# EAGLE design Msp430_doughter (EAGLE 4.16)
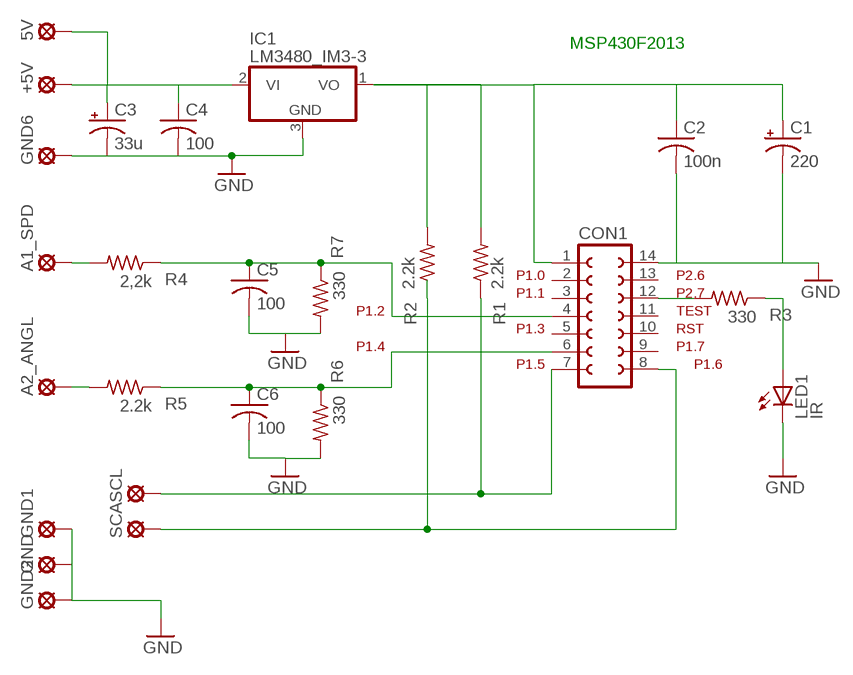
[diagram p0: schematic, sheet 1]

## Parts
5V  LSP10  [LSP10]
+5V  LSP10  [LSP10]
A1_SPD  LSP10  [LSP10]
A2_ANGL  LSP10  [LSP10]
C1  220  CPOL-USD/7343-31W  [D/7343-31W]
C2  100n  C-USC1206  [C1206]
C3  33u  CPOL-USD/7343-31R  [D/7343-31R]
C4  100  C-USC1206  [C1206]
C5  100  C-USC0805  [C0805]
C6  100  C-USC0805  [C0805]
CON1  HEADER_MSP430  [FE07-2]
GND  LSP10  [LSP10]
GND1  LSP10  [LSP10]
GND2  LSP10  [LSP10]
GND6  LSP10  [LSP10]
IC1  LM3480_IM3-3  LM340SOT23-  [SOT23]
LED1  IR  LED3MM  [LED3MM]
R1  2.2k  R-US_0204/7  [0204/7]
R2  2.2k  R-US_0204/7  [0204/7]
R3  330  R-US_R0805  [R0805]
R4  2,2k  R-US_R0805  [R0805]
R5  2.2k  R-US_R0805  [R0805]
R6  330  R-US_R0805  [R0805]
R7  330  R-US_R0805  [R0805]
SCA  LSP10  [LSP10]
SCL  LSP10  [LSP10]

## Nets
GND: C1.- C2.2 C3.- C4.2 C5.2 C6.2 CON1.14 GND1.MP GND2.MP GND6.MP GND.MP IC1.3(GND) LED1.K(C) R6.2 R7.2
N$1: C5.1 CON1.4 R4.1 R7.1
N$2: C6.1 CON1.6 R5.1 R6.1
N$3: C1.+ C2.1 CON1.1 IC1.1(VO) R1.2 R2.2
N$4: CON1.8 R2.1 SCA.MP
N$5: CON1.12 R3.2
N$6: 5V.MP +5V.MP C3.+ C4.1 IC1.2(VI)
N$7: CON1.7 R1.1 SCL.MP
N$8: LED1.A R3.1
N$9: A2_ANGL.MP R5.2
N$10: A1_SPD.MP R4.2
Unconnected: CON1.2 CON1.3 CON1.5 CON1.9 CON1.10 CON1.11 CON1.13

## Notes on the sheet
- MSP430F2013
- P1.0 | P2.6
- P1.1 | P2.7
- P1.2 | TEST
- P1.3 | RST
- P1.4 | P1.7
- P1.5 | P1.6

## Library data of the parts
5V +5V A1_SPD A2_ANGL GND GND1 GND2 GND6 SCA SCL = solpad:LSP10: SOLDER PAD drill 1.0 mm, distributor Buerklin, 12H555
C1 C3 = rcl:CPOL-US: POLARIZED CAPACITOR, American symbol
C2 C4-C6 = rcl:C-US: CAPACITOR, American symbol
CON1 = ZStofer:HEADER_MSP430: FEMALE HEADER
IC1 = ZStofer:LM340?-*: Positive VOLTAGE REGULATOR Source: http://cache.national.com/ds/LM/LM340.pdf
LED1 = led:LED: LED OSRAM: - CHIPLED LG R971, LG N971, LY N971, LG Q971, LY Q971, LO R971, LY R971 LH N974, LH R974 LS Q976, LO Q976, LY Q976 LO Q996 - Hyper CHIPLED LW Q18S LB Q993, LB Q99A, LB R99A - SideLED LS A670, LO A670, LY A670, LG A670, LP A670 LB A673, LV A673, LT A673, LW A673 LH A674 LY A675 LS A676, LA A676, LO A676, LY A676, LW A676 LS A679, LY A679, LG A679 - Hyper Micro SIDELED® LS Y876, LA Y876, LO Y876, LY Y876 LT Y87S - SmartLED LW L88C, LW L88S LB L89C, LB L89S, LG L890 LS L89K, LO L89K, LY L89K LS L896, LA L896, LO L896, LY L896 - TOPLED LS T670, LO T670, LY T670, LG T670, LP T670 LSG T670, LSP T670, LSY T670, LOP T670, LYG T670 LG T671, LOG T671, LSG T671 LB T673, LV T673, LT T673, LW T673 LH T674 LS T676, LA T676, LO T676, LY T676, LB T676, LH T676, LSB T676, LW T676 LB T67C, LV T67C, LT T67C, LS T67K, LO T67K, LY T67K, LW E67C LS E67B, LA E67B, LO E67B, LY E67B, LB E67C, LV E67C, LT E67C LW T67C LS T679, LY T679, LG T679 LS T770, LO T770, LY T770, LG T770, LP T770 LB T773, LV T773, LT T773, LW T773 LH T774 LS E675, LA E675, LY E675, LS T675 LS T776, LA T776, LO T776, LY T776, LB T776 LHGB T686 LT T68C, LB T68C - Hyper Mini TOPLED® LB M676 - Mini TOPLED Santana® LG M470 LS M47K, LO M47K, LY M47K Source: http://www.osram.convergy.de - LUMILED® LXK2-PW12-R00, LXK2-PW12-S00, LXK2-PW14-U00, LXK2-PW14-V00 LXK2-PM12-R00, LXK2-PM12-S00, LXK2-PM14-U00 LXK2-PE12-Q00, LXK2-PE12-R00, LXK2-PE12-S00, LXK2-PE14-T00, LXK2-PE14-U00 LXK2-PB12-K00, LXK2-PB12-L00, LXK2-PB12-M00, LXK2-PB14-N00, LXK2-PB14-P00, LXK2-PB14-Q00 LXK2-PR12-L00, LXK2-PR12-M00, LXK2-PR14-Q00, LXK2-PR14-R00 LXK2-PD12-Q00, LXK2-PD12-R00, LXK2-PD12-S00 LXK2-PH12-R00, LXK2-PH12-S00 LXK2-PL12-P00, LXK2-PL12-Q00, LXK2-PL12-R00 Source: www.luxeon.com
R1-R7 = rcl:R-US_: RESISTOR, American symbol

## Board
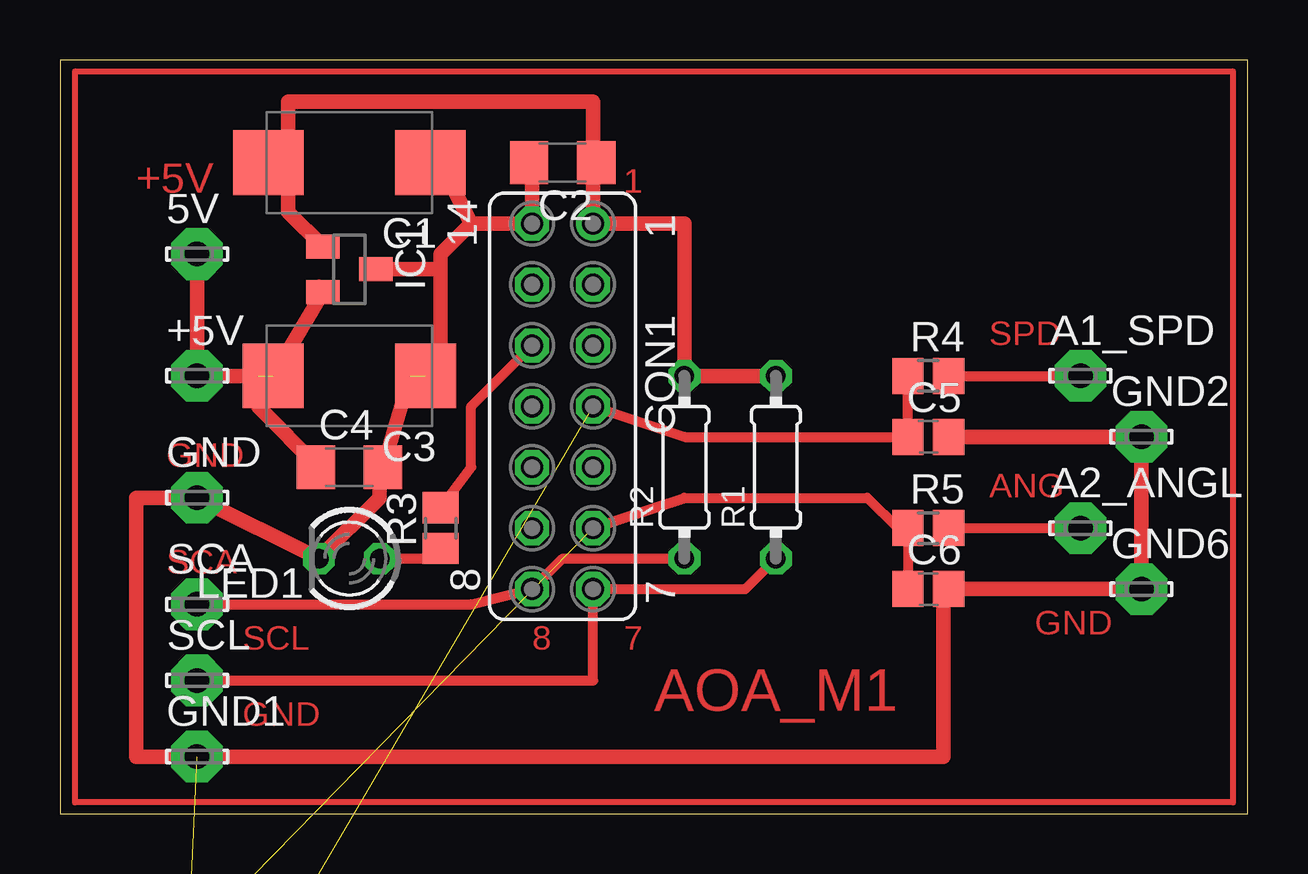
[diagram p1: board, top side]

Size 49.51 x 31.42 mm. Coordinates in mm from the lower left corner, seen from the top.
Outline: 0,0 49.51,0 49.51,31.42 0,31.42 0,0
Copper layers (1*2+15*16): Top 0.035mm / dielectric 0.2mm / Route2 0.035mm / dielectric 0.15mm / Route15 0.035mm / dielectric 0.2mm / Bottom 0.035mm
Design rules "default": minimum track width 10mil, minimum drill 24mil, track to track 8mil, track to pad 8mil, pad to pad 8mil, via to via 8mil, smd to smd 8mil, copper to edge 40mil, drill to drill 8mil, minimum pad ring 10mil, minimum via ring 8mil, stop-mask expansion 4mil, vias tented up to drill 0mil, thermal gap 10mil

### Footprints (pad centres in the part's own frame; a part is rotated, then mirrored left to right if it is on the bottom)
LSP10 = drill 1.016 pad 2.159 octagon: MP 0,0
D/7343-31W = smd 2.95 x 2.7: + 3.375,0; - -3.375,0
C1206 = smd 1.6 x 1.8: 1 -1.4,0; 2 1.4,0
D/7343-31R = smd 2.55 x 2.7: + 3.175,0; - -3.175,0
C0805 = smd 1.3 x 1.5: 1 -0.85,0; 2 0.85,0
FE07-2 = drill 0.914 round: 1 -7.62,1.27 | drill 0.914 octagon: 2 -5.08,1.27; 3 -2.54,1.27; 4 0,1.27; 5 2.54,1.27; 6 5.08,1.27; 7 7.62,1.27; 8 7.62,-1.27; 9 5.08,-1.27; 10 2.54,-1.27; 11 0,-1.27; 12 -2.54,-1.27; 13 -5.08,-1.27; 14 -7.62,-1.27
SOT23 = smd 1 x 1.4: 1 -0.95,-1.1; 2 0.95,-1.1; 3 0,1.1
LED3MM = drill 0.813 octagon: A -1.27,0; K 1.27,0
0204/7 = drill 0.813 octagon: 1 -3.81,0; 2 3.81,0
R0805 = smd 1.3 x 1.5: 1 -0.85,0; 2 0.85,0

### Placement (x,y rotation side)
5V  5.71,23.33 0 top
+5V  5.71,18.25 0 top
A1_SPD  42.54,18.25 0 top
A2_ANGL  42.54,11.9 0 top
C1  12.06,27.14 180 top
C2  20.95,27.14 180 top
C3  12.06,18.25 180 top
C4  12.06,14.44 0 top
C5  36.19,15.71 0 top
C6  36.19,9.36 0 top
CON1  20.95,16.98 270 top
GND  5.71,13.17 0 top
GND1  5.71,2.38 0 top
GND2  45.08,15.71 0 top
GND6  45.08,9.36 0 top
IC1  12.06,22.7 270 top
LED1  12.06,10.63 180 top
R1  29.84,14.44 90 top
R2  26.03,14.44 90 top
R3  15.87,11.9 90 top
R4  36.19,18.25 0 top
R5  36.19,11.9 0 top
R6  4.44,-7.15 0 top  (outside the outline)
R7  4.44,-14.77 0 top  (outside the outline)
SCA  5.71,8.72 0 top
SCL  5.71,5.55 0 top

### Tracks (layer width: path | path; a pad name or v marks a point on that pad's centre or on a via)
GND  (3 unrouted)
  Top 0.406: 13.33,14.44 C4.2 | C3.- 15.87,18.88 | 19.68,27.14 C2.2 | 15.87,23.33 15.87,22.7 | 15.87,27.14 C1.- | 36.83,9.36 C6.2
  Top 0.61: C6.2 GND6.MP GND2.MP C5.2 | 13.33,14.44 13.33,13.17 LED1.K GND.MP 3.17,13.17 3.17,2.38 GND1.MP 36.83,2.38 36.83,9.36 | C4.2 14.6,18.25 | 15.87,18.88 15.87,23.33 17.14,24.6 | 17.14,24.6 CON1.14 19.68,27.14 | 15.87,22.7 IC1.3 | 17.14,24.6 15.87,27.14
N$1  (1 unrouted)
  Top 0.406: R4.1 C5.1 26.03,15.71 CON1.4
N$2  (1 unrouted)
  Top 0.406: CON1.6 26.03,13.17 33.65,13.17 34.92,11.9 R5.1 C6.1 35.55,9.36
N$3
  Top 0.406: C1.+ 9.52,27.14 9.52,25.87 | 9.52,25.87 9.52,25.72 | 9.52,25.09 9.52,25.87 | 22.22,27.14 C2.1
  Top 0.61: R1.2 R2.2 26.03,24.6 CON1.1 22.22,27.14 22.22,29.68 9.52,29.68 9.52,27.14 9.52,25.09 IC1.1
N$4
  Top 0.406: SCA.MP 17.14,8.72 CON1.8 20.95,10.63 R2.1
N$5
  Top 0.406: R3.2 17.14,14.44 17.14,16.98 CON1.12
N$6  (1 unrouted)
  Top 0.406: IC1.2 10.79,22.06 | C4.1 10.79,14.44 | 8.25,16.98 8.25,18.25
  Top 0.61: 8.25,18.25 +5V.MP 5V.MP | 10.79,14.44 8.25,16.98 | IC1.2 10.79,21.43 C3.+
N$7
  Top 0.406: R1.1 28.57,9.36 CON1.7 22.22,5.55 SCL.MP
N$8
  Top 0.406: R3.1 15.87,10.63 LED1.A
N$9
  Top 0.406: R5.2 A2_ANGL.MP
N$10
  Top 0.406: R4.2 A1_SPD.MP R4.2
N$11
  Top 0.254: 0.63,30.95 48.89,30.95 48.89,0.47 0.63,0.47 0.63,30.95

### Text on the board
Top: +5V | 1 | SPD | GND | ANG | SCA | GND | SCL | 8 | 7 | GND | AOA_M1